# EAGLE schematic GrooveCard (EAGLE 8.3.1)
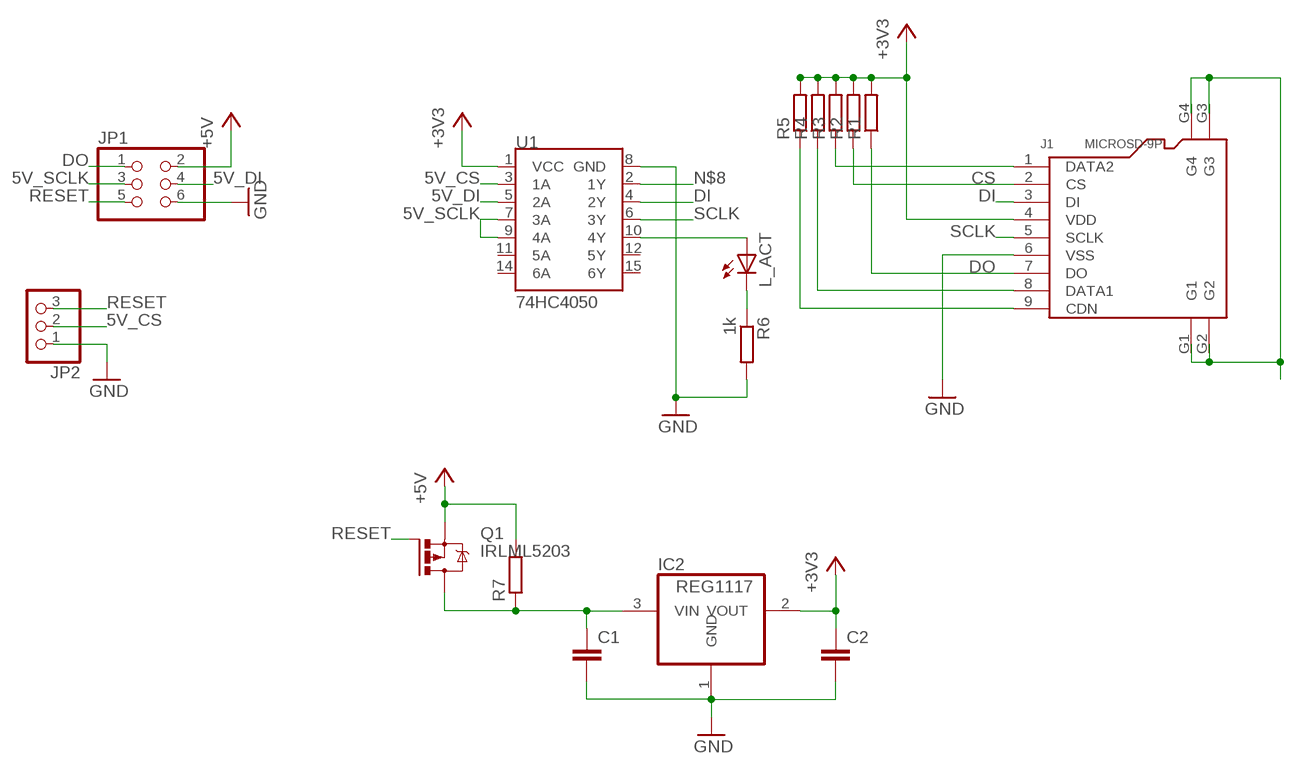
[diagram p0: schematic, sheet 1]

## Parts
C1  C-EUC0805  [C0805]
C2  C-EUC0805  [C0805]
IC2  REG1117  [SOT223]
J1  MICROSD-9P  MICRO-SD-CARD-HOLDER-9P  [MICRO-SD9+4P-SMD-16.1X14.5X1.85MM]
JP1  PINHD-2X3  [2X03]
JP2  PINHD-1X3  [1X03]
L_ACT  LEDCHIPLED_0805  [CHIPLED_0805]
Q1  IRLML5203  [MICRO3]
R1  R-EU_M0805  [M0805]
R2  R-EU_M0805  [M0805]
R3  R-EU_M0805  [M0805]
R4  R-EU_M0805  [M0805]
R5  R-EU_M0805  [M0805]
R6  1k  R-EU_M0805  [M0805]
R7  R-EU_R0805  [R0805]
U1  74HC4050  HEX_CONVERTER  [SO16]

## Nets
5V_CS: JP2.2 U1.3(1A)
5V_DI: JP1.4 U1.5(2A)
5V_SCLK: JP1.3 U1.7(3A) U1.9(4A)
+3V3: C2.1 IC2.2(VOUT) J1.4(VDD) R1.2 R2.2 R3.2 R4.2 R5.2 U1.1(VCC)
+5V: JP1.2 Q1.2(S) R7.2
CS: J1.2(CS) R2.1
DI: J1.3(DI) U1.4(2Y)
DO: J1.7(DO) JP1.1 R1.1
GND: C1.2 C2.2 IC2.1(GND) J1.6(VSS) JP1.6 JP2.1 R6.2 U1.8(GND)
N$1: L_ACT.A U1.10(4Y)
N$3: J1.8(DATA1) R4.1
N$4: J1.1(DATA2) R3.1
N$5: J1.9(CDN) R5.1
N$6: L_ACT.C R6.1
N$7: C1.1 IC2.3(VIN) Q1.3(D) R7.1
N$8: U1.2(1Y)
RESET: JP1.5 JP2.3 Q1.1(G)
SCLK: J1.5(SCLK) U1.6(3Y)
Unconnected: J1.G1 J1.G2 J1.G3 J1.G4 U1.11(5A) U1.12(5Y) U1.14(6A) U1.15(6Y)

## Library data of the parts
C1 C2 = resistor:C-EU: CAPACITOR, European symbol
IC2 = burr-brown:REG1117: 800mA and 1A Low Dropout (LDO) Positive Regulator 1.8V, 2.5V, 2.85V, 3.3V, 5V, and Adj; MPN: REG1117; OC_FARNELL: 1097566; OC_NEWARK: 14P6981
J1 = Seeed-Connector:MICRO-SD-CARD-HOLDER-9P: 320090008
JP1 = pinhead:PINHD-2X3: PIN HEADER
JP2 = pinhead:PINHD-1X3: PIN HEADER
L_ACT = led:LED: LED OSRAM: - CHIPLED LG R971, LG N971, LY N971, LG Q971, LY Q971, LO R971, LY R971 LH N974, LH R974 LS Q976, LO Q976, LY Q976 LO Q996 - Hyper CHIPLED LW Q18S LB Q993, LB Q99A, LB R99A - SideLED LS A670, LO A670, LY A670, LG A670, LP A670 LB A673, LV A673, LT A673, LW A673 LH A674 LY A675 LS A676, LA A676, LO A676, LY A676, LW A676 LS A679, LY A679, LG A679 - Hyper Micro SIDELED® LS Y876, LA Y876, LO Y876, LY Y876 LT Y87S - SmartLED LW L88C, LW L88S LB L89C, LB L89S, LG L890 LS L89K, LO L89K, LY L89K LS L896, LA L896, LO L896, LY L896 - TOPLED LS T670, LO T670, LY T670, LG T670, LP T670 LSG T670, LSP T670, LSY T670, LOP T670, LYG T670 LG T671, LOG T671, LSG T671 LB T673, LV T673, LT T673, LW T673 LH T674 LS T676, LA T676, LO T676, LY T676, LB T676, LH T676, LSB T676, LW T676 LB T67C, LV T67C, LT T67C, LS T67K, LO T67K, LY T67K, LW E67C LS E67B, LA E67B, LO E67B, LY E67B, LB E67C, LV E67C, LT E67C LW T67C LS T679, LY T679, LG T679 LS T770, LO T770, LY T770, LG T770, LP T770 LB T773, LV T773, LT T773, LW T773 LH T774 LS E675, LA E675, LY E675, LS T675 LS T776, LA T776, LO T776, LY T776, LB T776 LHGB T686 LT T68C, LB T68C - Hyper Mini TOPLED® LB M676 - Mini TOPLED Santana® LG M470 LS M47K, LO M47K, LY M47K Source: http://www.osram.convergy.de LUXEON: - LUMILED® LXK2-PW12-R00, LXK2-PW12-S00, LXK2-PW14-U00, LXK2-PW14-V00 LXK2-PM12-R00, LXK2-PM12-S00, LXK2-PM14-U00 LXK2-PE12-Q00, LXK2-PE12-R00, LXK2-PE12-S00, LXK2-PE14-T00, LXK2-PE14-U00 LXK2-PB12-K00, LXK2-PB12-L00, LXK2-PB12-M00, LXK2-PB14-N00, LXK2-PB14-P00, LXK2-PB14-Q00 LXK2-PR12-L00, LXK2-PR12-M00, LXK2-PR14-Q00, LXK2-PR14-R00 LXK2-PD12-Q00, LXK2-PD12-R00, LXK2-PD12-S00 LXK2-PH12-R00, LXK2-PH12-S00 LXK2-PL12-P00, LXK2-PL12-Q00, LXK2-PL12-R00 Source: www.luxeon.com KINGBRIGHT: KA-3528ASYC Source: www.kingbright.com
Q1 = transistor-power:IRLML5203: HEXFET P-Channel Power MOSFET
R1-R7 = resistor:R-EU_: RESISTOR, European symbol
U1 = SparkFun-IC-Comms:HEX_CONVERTER: 74HC4050 Hex Buffer 74HC4050 Hex Buffer Level Shifter SMD SO016 SparkFun Products CAN-BUS Shield <https://www.sparkfun.com/products/13262> (DEV-13262) SparkFun MP3 Player Shield <https://www.sparkfun.com/products/12660> (DEV-12660) SparkFun microSD Shield <https://www.sparkfun.com/products/12761> (DEV-12761) SparkFun USB Host Shield <https://www.sparkfun.com/products/9947> (DEV-09947); PROD_ID: IC-09604